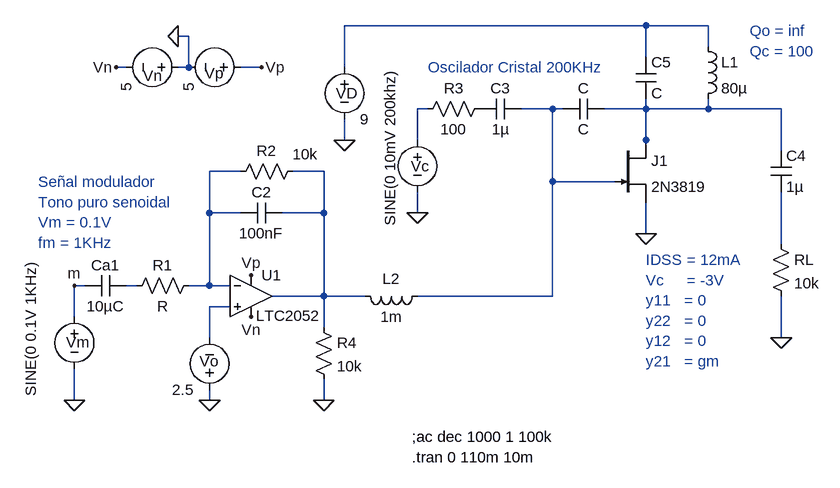
[diagram p0: schematic FM.asc]
FM.asc, the LTspice schematic file:
Version 4
SHEET 1 880 680
WIRE 240 -112 -224 -112
WIRE 336 -112 240 -112
WIRE -464 -96 -480 -96
WIRE 336 -80 336 -112
WIRE 240 -64 240 -112
WIRE -560 -48 -576 -48
WIRE -464 -48 -464 -96
WIRE -464 -48 -480 -48
WIRE -352 -48 -384 -48
WIRE -224 -48 -224 -112
WIRE -96 16 -112 16
WIRE 96 16 48 16
WIRE 112 16 96 16
WIRE 240 16 240 0
WIRE 240 16 176 16
WIRE 336 16 336 0
WIRE 336 16 240 16
WIRE 448 16 336 16
WIRE -224 64 -224 32
WIRE -112 64 -112 16
WIRE 240 64 240 16
WIRE 240 80 240 64
WIRE 448 80 448 16
WIRE -384 112 -432 112
WIRE -256 112 -304 112
WIRE 96 128 96 16
WIRE 192 128 96 128
WIRE -432 176 -432 112
WIRE -384 176 -432 176
WIRE -256 176 -256 112
WIRE -256 176 -320 176
WIRE -112 176 -112 144
WIRE 240 208 240 160
WIRE 448 224 448 144
WIRE -624 288 -640 288
WIRE -544 288 -560 288
WIRE -432 288 -432 176
WIRE -432 288 -464 288
WIRE -400 288 -432 288
WIRE -256 304 -256 176
WIRE -256 304 -336 304
WIRE -192 304 -256 304
WIRE 96 304 96 128
WIRE 96 304 -112 304
WIRE -400 320 -432 320
WIRE -640 336 -640 288
WIRE -256 352 -256 304
WIRE -432 368 -432 320
WIRE 448 368 448 304
WIRE -640 464 -640 416
WIRE -432 464 -432 448
WIRE -256 464 -256 432
FLAG -224 64 0
FLAG -112 176 0
FLAG -432 464 0
FLAG -640 464 0
FLAG -480 -96 0
FLAG -352 -48 Vp
FLAG -368 272 Vp
FLAG -576 -48 Vn
FLAG -368 336 Vn
FLAG -256 464 0
FLAG -640 288 m
FLAG 240 208 0
FLAG 448 368 0
SYMBOL njf 192 64 R0
SYMATTR InstName J1
SYMATTR Value 2N3819
SYMBOL voltage -224 -64 R0
WINDOW 0 -13 56 Left 2
SYMATTR InstName VD
SYMATTR Value 9
SYMBOL ind 320 -96 R0
SYMATTR InstName L1
SYMATTR Value 80µ
SYMBOL cap 176 0 R90
WINDOW 0 0 32 VBottom 2
WINDOW 3 32 32 VTop 2
SYMATTR InstName C
SYMBOL cap 48 0 R90
WINDOW 0 0 32 VBottom 2
WINDOW 3 32 32 VTop 2
SYMATTR InstName C3
SYMATTR Value 1µ
SYMBOL res 0 0 R90
WINDOW 0 0 56 VBottom 2
WINDOW 3 32 56 VTop 2
SYMATTR InstName R3
SYMATTR Value 100
SYMBOL voltage -112 48 R0
WINDOW 123 0 0 Left 0
WINDOW 39 0 0 Left 0
WINDOW 0 -10 56 Left 2
WINDOW 3 -42 148 VLeft 2
SYMATTR InstName Vc
SYMATTR Value SINE(0 10mV 200khz)
SYMBOL cap 224 -64 R0
SYMATTR InstName C5
SYMBOL res 432 208 R0
SYMATTR InstName RL
SYMATTR Value 10k
SYMBOL res -448 272 R90
WINDOW 0 0 56 VBottom 2
WINDOW 3 32 56 VTop 2
SYMATTR InstName R1
SYMBOL res -288 96 R90
WINDOW 0 0 56 VBottom 2
WINDOW 3 -26 -3 VTop 2
SYMATTR InstName R2
SYMATTR Value 10k
SYMBOL cap -320 160 R90
WINDOW 0 0 32 VBottom 2
WINDOW 3 32 32 VTop 2
SYMATTR InstName C2
SYMATTR Value 100nF
SYMBOL cap -560 272 R90
WINDOW 0 0 32 VBottom 2
WINDOW 3 32 32 VTop 2
SYMATTR InstName Ca1
SYMATTR Value 10µC
SYMBOL voltage -432 464 R180
WINDOW 0 -14 60 Left 2
WINDOW 3 24 16 Left 2
WINDOW 123 0 0 Left 2
WINDOW 39 0 0 Left 2
SYMATTR InstName Vo
SYMATTR Value 2.5
SYMBOL voltage -640 320 R0
WINDOW 123 0 0 Left 2
WINDOW 39 0 0 Left 2
WINDOW 3 -67 138 VLeft 2
WINDOW 0 -13 55 Left 2
SYMATTR Value SINE(0 0.1V 1KHz)
SYMATTR InstName Vm
SYMBOL Opamps\\LTC2052 -368 304 R0
WINDOW 3 8 30 Left 2
SYMATTR InstName U1
SYMBOL voltage -368 -48 R90
WINDOW 123 0 0 Left 2
WINDOW 39 0 0 Left 2
WINDOW 0 9 42 VRight 2
SYMATTR InstName Vp
SYMATTR Value 5
SYMBOL voltage -464 -48 R90
WINDOW 123 0 0 Left 2
WINDOW 39 0 0 Left 2
WINDOW 0 13 41 VRight 2
SYMATTR InstName Vn
SYMATTR Value 5
SYMBOL res -272 336 R0
SYMATTR InstName R4
SYMATTR Value 10k
SYMBOL cap 432 80 R0
SYMATTR InstName C4
SYMATTR Value 1µ
SYMBOL ind -96 288 R90
WINDOW 0 5 56 VBottom 2
WINDOW 3 32 56 VTop 2
SYMATTR InstName L2
SYMATTR Value 1m
TEXT -120 552 Left 2 !.tran 0 110m 10m
TEXT 240 248 Left 2 ;IDSS = 12mA\nVc     = -3V\ny11   = 0\ny22   = 0\ny12   = 0\ny21   = gm
TEXT -120 520 Left 2 !;ac dec 1000 1 100k
TEXT -96 -48 Left 2 ;Oscilador Cristal 200KHz
TEXT -696 128 Left 2 ;Señal modulador\nTono puro senoidal \nVm = 0.1V\nfm = 1KHz
TEXT 400 -104 Left 2 ;Qo = inf\nQc = 100

The netlist it stands for:
* FM.asc
J1 N004 N003 0 2N3819
VD N001 0 9
L1 N001 N004 80µ
C N004 N003 C
C3 N003 P001 1µ
R3 P001 N002 100
Vc N002 0 SINE(0 10mV 200khz)
C5 N001 N004 C
RL N007 0 10k
R1 N005 N008 R
R2 N006 N005 10k
C2 N006 N005 100nF
Ca1 N008 m 10µC
Vo 0 N009 2.5
Vm m 0 SINE(0 0.1V 1KHz)
* U1: LTC2052 (symbol Opamps\LTC2052 not available, pins judged from their places): In+=N009 In-=N005 V+=Vp V-=Vn OUT=N006
Vp Vp 0 5
Vn 0 Vn 5
R4 N006 0 10k
C4 N004 N007 1µ
L2 N003 N006 1m
.model NJF NJF
.model PJF PJF
.lib standard.jft
.tran 0 110m 10m
* IDSS = 12mA
* Vc     = -3V
* y11   = 0
* y22   = 0
* y12   = 0
* y21   = gm
;ac dec 1000 1 100k
* Oscilador Cristal 200KHz
* Señal modulador
* Tono puro senoidal
* Vm = 0.1V
* fm = 1KHz
* Qo = inf
* Qc = 100
.backanno
.end